# EasyEDA Pro project ProPrj_fallctf2025badge_2025-09-24.epro, board badge-v0.1_2025-02-24
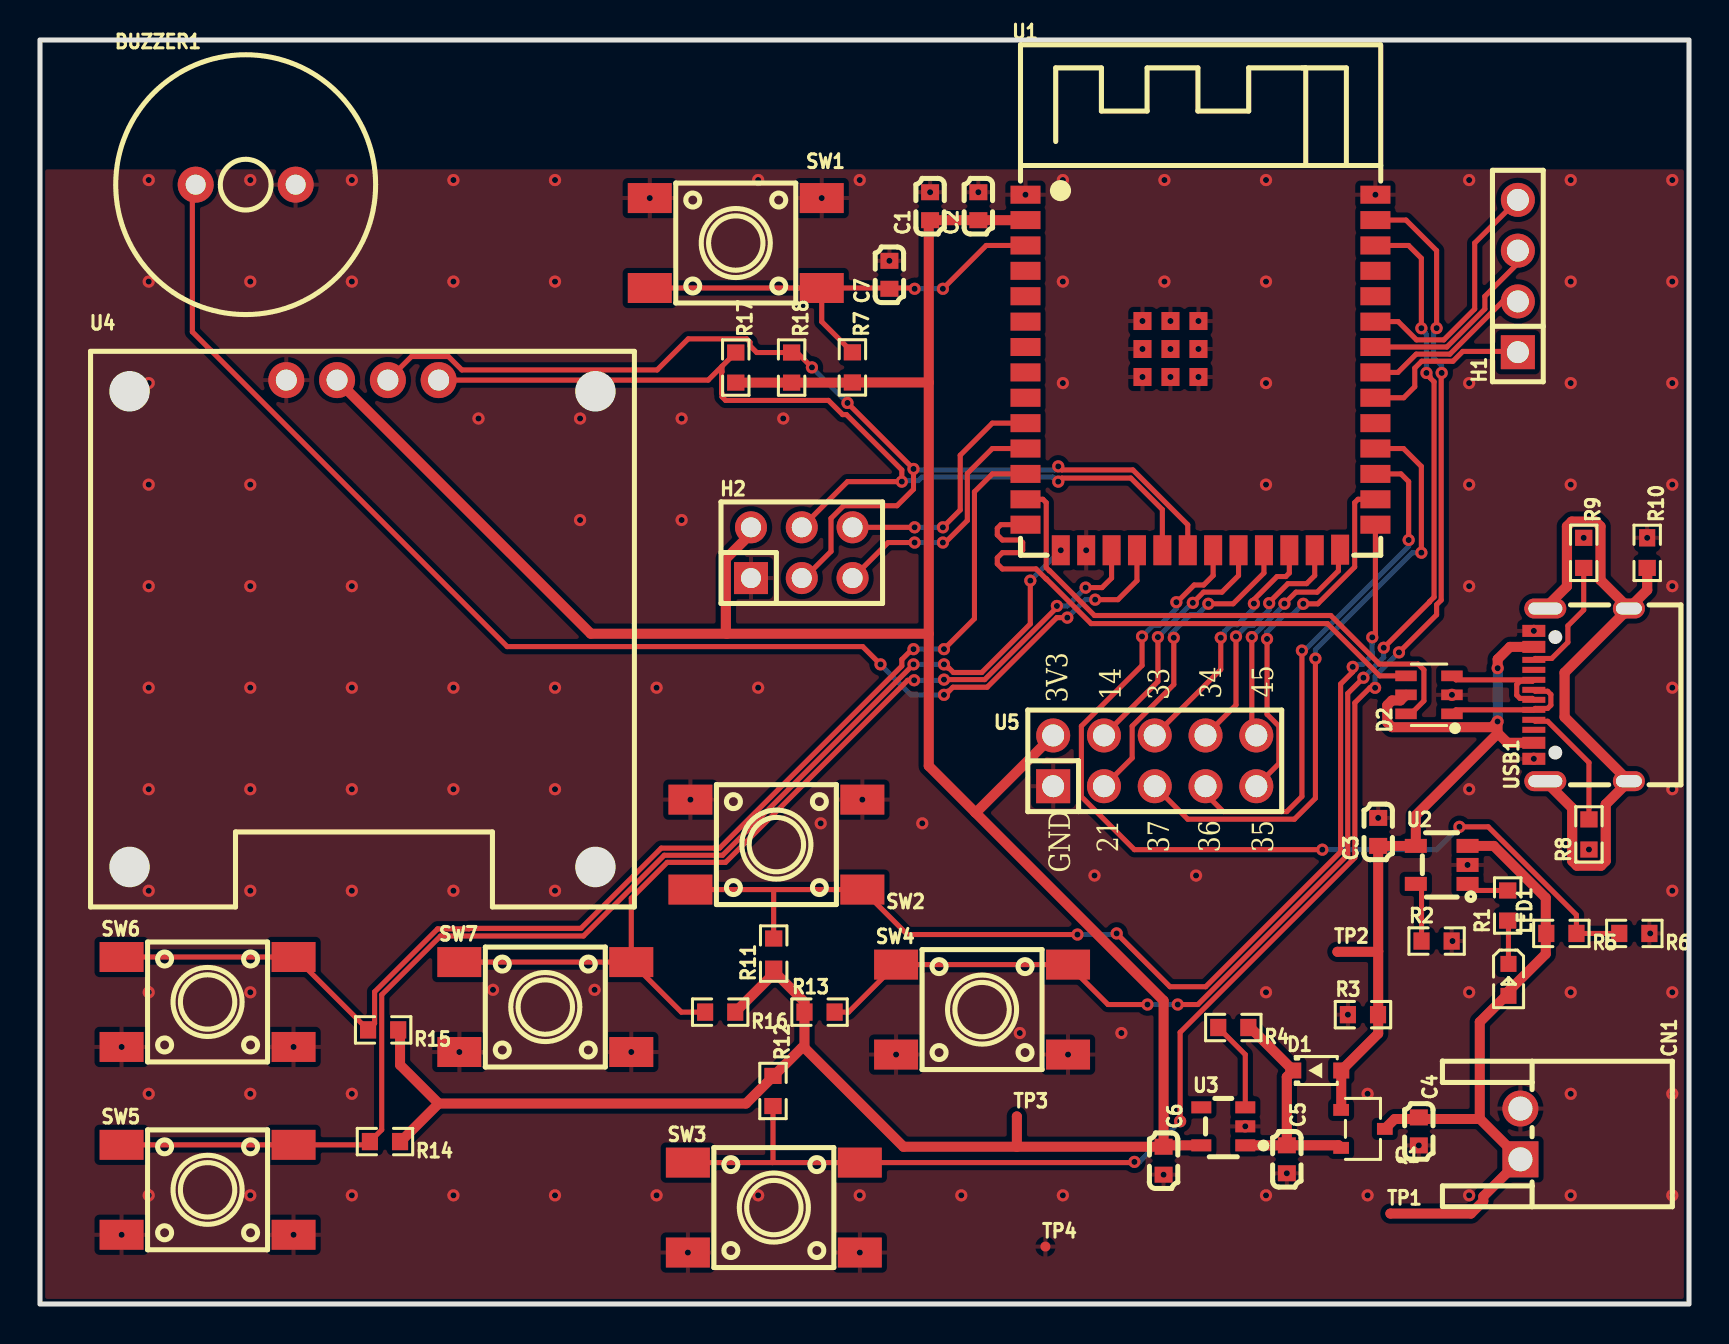
[diagram p13: board, top side]
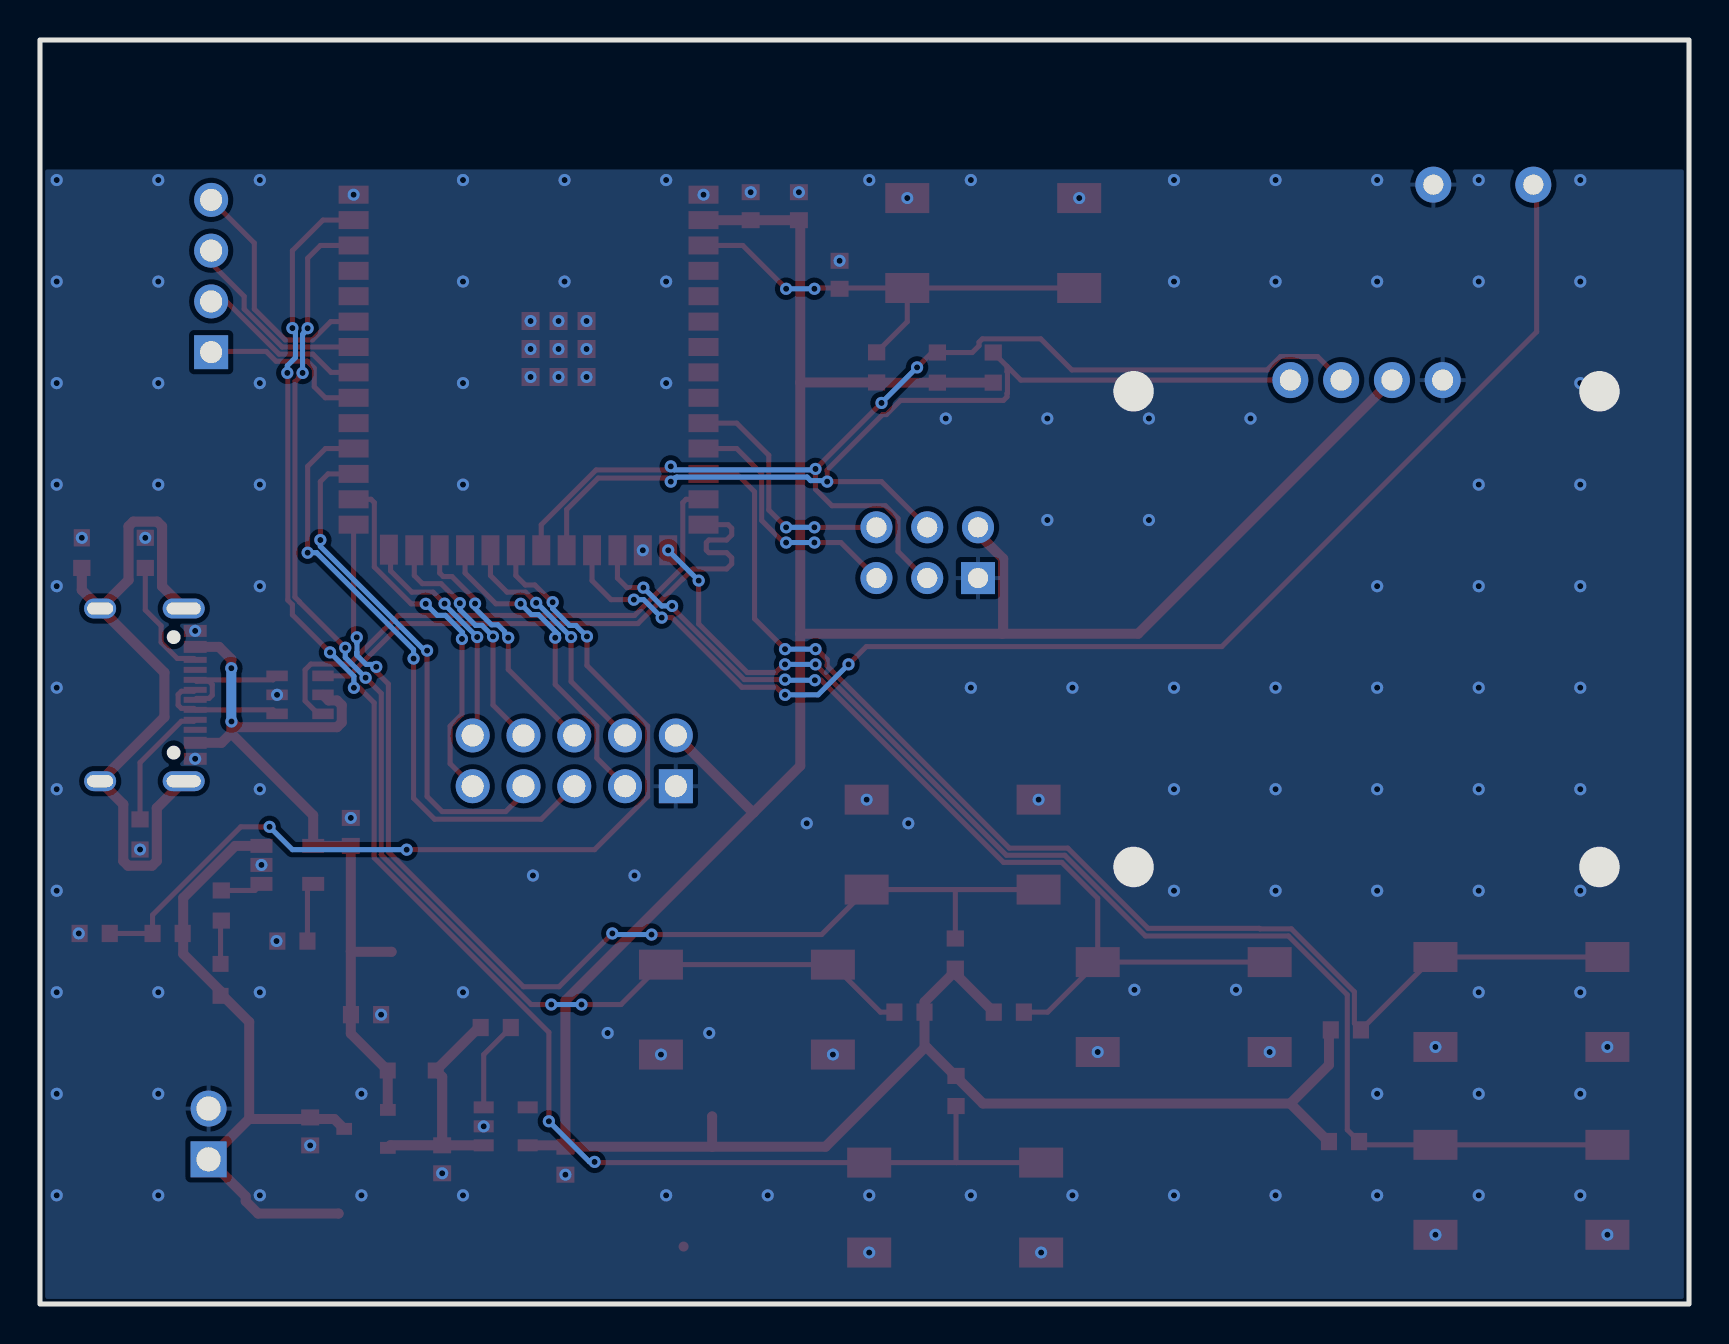
[diagram p14: board, bottom side, seen from below]

Outline 82.47 x 63.25 mm; copper layers: Top Layer, Bottom Layer. Coordinates in mm from the lower left corner of the outline.
Outline path: rectangle 0,63.25 82.47,0
Stack: Top Layer 0.035mm / Dielectric1 1.51mm FR4 er 4.5 / Bottom Layer 0.035mm

## Design rules (mm)
net D+: DP1
net D-: DP1
template: Custom Config
spacing copperThickness1oz (default): track to track 0.102, other pairs 0.15 to 0.3
spacing copperThickness2oz: track to track 0.203, other pairs 0.152 to 0.3
track width copperThickness1oz (default): min 0.127, default 0.254, max 2.54
track width copperThickness2oz: min 0.203, default 0.254, max 2.54
track width powerWidth: min 0.5, default 0.5, max 2.54
differential pair differentialPair (default): width min 0.127, default 0.254, max 2.54; gap min 0.152, default 0.152
via viaSize (default): diameter min 0.5, default 0.61, max 10; hole min 0.3, default 0.305, max 6.3
net +5V uses powerWidth
net +3.3V uses powerWidth
net VBAT uses powerWidth

## Placement (name value [footprint] x y rotation side)
BUZZER1  4kHz  [BUZ-TH_BD12.5-P5.00-D0.9]  10.29 56.01 0 top
C1  22uF  [C0603]  44.52 54.93 90 top
C2  100nF  [C0603]  46.93 54.93 90 top
C3  4.7uF  [C0603]  66.93 23.62 90 top
C4  10uF  [C0603]  68.96 8.64 270 top
C5  10uF  [C0603]  62.36 7.24 270 top
C6  10uF  [C0603]  56.2 7.17 270 top
C7  1uF  [C0603]  42.48 51.5 90 top
CN1  S2B-XH-A-1(LF)(SN)  [CONN-TH_S2B-XH-A-1-LF-SN]  74.04 8.51 270 top
D1  1N5819WS  [SOD-323_L1.7-W1.3-LS2.5-RD]  63.88 11.68 0 top
D2  USBLC6-2SC6  [SOT-23-6_L2.9-W1.6-P0.95-LS2.8-BL]  69.47 30.48 90 top
H1  2.54-1*4P母  [HDR-TH_4P-P2.54-V-F]  73.91 51.44 90 top
H2  PM2.54-2*3  [HDR-TH_6P-P2.54-V-F-R2-C3-S2.54]  38.1 37.59 0 top
LED1  D-060306R1/SS2/L  [LED0603-RD]  73.44 16.22 270 top
Q1  SSM3J338R,LF  [SOT-23F_L2.9-W1.8-P0.95-LS2.4-BR]  66.17 8.76 180 top
R1  300  [R0603#2]  73.41 19.94 90 top
R2  3.3K  [R0603#2]  69.85 18.16 0 top
R3  10K  [R0603#2]  66.17 14.48 0 top
R4  10K  [R0603#2]  59.68 13.83 180 top
R5  100K  [R0603#2]  76.09 18.54 180 top
R6  100K  [R0603#2]  79.74 18.54 180 top
R7  10K  [R0603#2]  40.63 46.86 270 top
R8  5K1  [R0603#2]  77.47 23.5 90 top
R9  5K1  [R0603#2]  77.21 37.58 270 top
R10  1M1  [R0603]  80.38 37.58 270 top
R11  10K  [R0603#2]  36.69 17.53 90 top
R12  10K  [R0603#2]  36.66 10.66 270 top
R13  10K  [R0603#2]  38.99 14.61 0 top
R14  10K  [R0603#2]  17.25 8.13 180 top
R15  10K  [R0603#2]  17.16 13.72 180 top
R16  10K  [R0603#2]  34.02 14.61 180 top
R17  4K7  [R0603#2]  34.8 46.85 270 top
R18  4K7  [R0603#2]  37.59 46.85 270 top
SW1  TS-1102S-C-C-B  [KEY-SMD_4P-L6.0-W6.0-P4.50-LS8.6]  34.8 53.09 180 top
SW2  TS-1102S-C-C-B  [KEY-SMD_4P-L6.0-W6.0-P4.50-LS8.6]  36.83 22.99 180 top
SW3  TS-1102S-C-C-B  [KEY-SMD_4P-L6.0-W6.0-P4.50-LS8.6]  36.7 4.83 0 top
SW4  TS-1102S-C-C-B  [KEY-SMD_4P-L6.0-W6.0-P4.50-LS8.6]  47.12 14.73 0 top
SW5  TS-1102S-C-C-B  [KEY-SMD_4P-L6.0-W6.0-P4.50-LS8.6]  8.38 5.72 0 top
SW6  TS-1102S-C-C-B  [KEY-SMD_4P-L6.0-W6.0-P4.50-LS8.6]  8.38 15.11 0 top
SW7  TS-1102S-C-C-B  [KEY-SMD_4P-L6.0-W6.0-P4.50-LS8.6]  25.27 14.86 0 top
TP1  -  [Test-Point-0.5mm]  67.54 4.53 0 top
TP2  -  [Test-Point-0.5mm]  64.89 17.62 0 top
TP3  -  [Test-Point-0.5mm]  48.86 9.38 0 top
TP4  -  [Test-Point-0.5mm]  50.29 2.88 0 top
U1  2.4GHz  [WIRELM-SMD_ESP32-S3-WROOM-1]  58.04 46.61 0 top
U2  TP4054  [TSOT-23-5_L2.9-W1.6-P0.95-LS2.8-BR]  70.1 21.97 0 top
U3  XC6220B331MR  [SOT-23-5_L2.9-W1.6-P0.95-LS2.8-BR]  59.18 8.89 0 top
U4  SSD1315  [OLED-TH_L27.8-W27.2-P2.54_C9900033791]  16.13 46.23 0 top
U5  ZX-PZ2.54-2-5PZZ  [HDR-TH_10P-P2.54-V-M-R2-C5-S2.54]  55.75 27.18 0 top
USB1  HC-TYPE-C-16P-01A-L  [USB-C-SMD_G-SWITCH_GT-USB-7010EN]  77.09 30.48 90 top

## Footprints (pads in the part's own frame, mm; a bottom-side part is the same pattern mirrored in y, then rotated)
BUZ-TH_BD12.5-P5.00-D0.9
  round 1.8 hole 1: 1(-2.5,0) 2(2.5,0)
C0603
  rect 0.8x0.9 smd: 1(-0.7,0) 2(0.7,0)
CONN-TH_S2B-XH-A-1-LF-SN
  rect 1.8x1.8 hole 1.2: 1(1.27,0)
  round 1.8 hole 1.2: 2(-1.27,0)
HDR-TH_4P-P2.54-V-F
  rect 1.7x1.7 hole 1.1: 1(-3.81,0)
  round 1.7 hole 1.1: 2(-1.27,0) 3(1.27,0) 4(3.81,0)
HDR-TH_6P-P2.54-V-F-R2-C3-S2.54
  rect 1.7x1.6 hole 1: 1(-2.54,-1.27)
  round 1.6 hole 1: 2(-2.54,1.27) 3(0,-1.27) 4(0,1.27) 5(2.54,-1.27) 6(2.54,1.27)
HDR-TH_10P-P2.54-V-M-R2-C5-S2.54
  rect 1.7x1.7 hole 1.1: 1(-5.08,-1.27)
  round 1.7 hole 1.1: 2(-5.08,1.27) 3(-2.54,-1.27) 4(-2.54,1.27) 5(0,-1.27) 6(0,1.27) 7(2.54,-1.27) 8(2.54,1.27) 9(5.08,-1.27) 10(5.08,1.27)
KEY-SMD_4P-L6.0-W6.0-P4.50-LS8.6
  rect 2.2x1.5 smd: 1(-4.3,2.25) 2(4.3,2.25) 3(-4.3,-2.25) 4(4.3,-2.25)
LED0603-RD
  rect 0.8x0.8 smd: 1(-0.799,0) 2(0.799,0)
OLED-TH_L27.8-W27.2-P2.54_C9900033791
  round 1.8 hole 1.05: 1(-3.81,0) 2(-1.27,0) 3(1.27,0) 4(3.81,0)
R0603
  rect 0.864x0.806 smd: 1(-0.753,0)
  rect 0.806x0.864 smd: 2(0.753,0)
R0603#2
  rect 0.806x0.864 smd: 1(-0.753,0) 2(0.753,0)
SOD-323_L1.7-W1.3-LS2.5-RD
  rect 0.8x0.8 smd: 1(-1.2,0) 2(1.2,0)
SOT-23-5_L2.9-W1.6-P0.95-LS2.8-BR
  rect 1x0.6 smd: 1(1.1,-0.95) 2(1.1,0) 3(1.1,0.95) 4(-1.1,0.95) 5(-1.1,-0.95)
SOT-23-6_L2.9-W1.6-P0.95-LS2.8-BL
  rect 0.532x1.072 smd: 1(-0.95,-1.149) 2(0,-1.149) 3(0.95,-1.149) 4(0.95,1.149) 5(0,1.149) 6(-0.95,1.149)
SOT-23F_L2.9-W1.8-P0.95-LS2.4-BR
  rect 0.785x0.595 smd: 1(1.093,-0.95) 2(1.093,0.95) 3(-1.093,0)
Test-Point-0.5mm
  round 0.5 smd: 1(0,0)
TSOT-23-5_L2.9-W1.6-P0.95-LS2.8-BR
  rect 1.1x0.7 smd: 1(1.294,-0.951) 2(1.294,-0.001) 3(1.294,0.951) 4(-1.294,0.951) 5(-1.294,-0.949)
USB-C-SMD_G-SWITCH_GT-USB-7010EN
  oval 1x2.1 hole 0.6x1.7: 1(-4.32,1.802) 2(4.32,1.802)
  oval 1x1.6 hole 0.6x1.3: 3(4.32,-2.377) 4(-4.32,-2.377)
  rect 0.6x1.15 smd: A1B12(-3.2,2.377) A4B9(-2.4,2.377) B1A12(3.2,2.377) B4A9(2.4,2.377)
  rect 0.3x1.15 smd: A5(-1.25,2.377) A6(-0.25,2.377) A7(0.25,2.377) A8(1.25,2.377) B5(1.75,2.377) B6(0.75,2.377) B7(-0.75,2.377) B8(-1.75,2.377)
WIRELM-SMD_ESP32-S3-WROOM-1
  rect 1.5x0.9 smd: 1(-8.75,8.895) 2(-8.75,7.625) 3(-8.75,6.355) 4(-8.75,5.085) 5(-8.75,3.815) 6(-8.75,2.545) 7(-8.75,1.275) 8(-8.75,0.005) 9(-8.75,-1.265) 10(-8.75,-2.535) 11(-8.75,-3.805) 12(-8.75,-5.075) 13(-8.75,-6.345) 14(-8.75,-7.615) 27(8.75,-7.615) 28(8.75,-6.345) 29(8.75,-5.075) 30(8.75,-3.805) 31(8.75,-2.535) 32(8.75,-1.265) 33(8.75,0.005) 34(8.75,1.275) 35(8.75,2.545) 36(8.75,3.815) 37(8.75,5.085) 38(8.75,6.355) 39(8.75,7.625) 40(8.75,8.895)
  rect 0.9x1.5 smd: 15(-6.985,-8.895) 16(-5.715,-8.895) 17(-4.445,-8.895) 18(-3.175,-8.895) 19(-1.905,-8.895) 20(-0.635,-8.895) 21(0.635,-8.895) 22(1.905,-8.895) 23(3.175,-8.895) 24(4.445,-8.895) 25(5.715,-8.895) 26(6.985,-8.865)
  rect 0.9x0.9 smd: 41(-2.9,2.575) 41(-2.9,1.175) 41(-2.9,-0.225) 41(-1.5,2.575) 41(-1.5,1.175) 41(-1.5,-0.225) 41(-0.1,2.575) 41(-0.1,1.175) 41(-0.1,-0.225)

## Nets
+3.3V: C1.1 C2.1 C6.1 H2.2 R7.2 R11.1 R12.1 R13.1 R14.1 R15.1 R16.1 R17.2 R18.2 TP3.1 U1.2 U3.5 U4.2 U5.2
+5V: C3.1 D1.2 D2.5 Q1.1 R3.2 TP2.1 U2.4 USB1.A4B9 USB1.B4A9
GND: BUZZER1.2 C1.2 C2.2 C3.2 C4.2 C5.2 C6.2 C7.2 CN1.2 D2.2 H2.1 R2.2 R3.1 R6.1 R8.1 R9.1 R10.1 SW1.3 SW1.4 SW2.3 SW2.4 SW3.3 SW3.4 SW4.3 SW4.4 SW5.3 SW5.4 SW6.3 SW6.4 SW7.3 SW7.4 TP4.1 U1.1 U1.16 U1.40 U1.41 U2.2 U3.2 U4.1 U5.1 USB1.A1B12 USB1.B1A12
VBAT: C4.1 CN1.1 LED1.2 Q1.3 R5.2 TP1.1 U2.3
BTN0: R11.2 SW2.1 SW2.2 U1.27
BTN1: R12.2 SW3.1 SW3.2 U1.39
BTN2: R13.2 SW4.1 SW4.2 U1.38
BTN3: R14.2 SW5.1 SW5.2 U1.15
BTN4: R15.2 SW6.1 SW6.2 U1.12
BTN5: R16.2 SW7.1 SW7.2 U1.17
BUZZ: BUZZER1.1 U1.18
CHG: R5.1 R6.2 U1.21
D+: D2.4 U1.14
D-: D2.6 U1.13
EN: C7.1 R7.1 SW1.1 SW1.2 U1.3
IO14: U1.22 U5.4
IO21: U1.23 U5.3
IO33: U1.24 U5.6
IO34: U1.25 U5.8
IO35: U1.28 U5.9
IO36: U1.29 U5.7
IO37: U1.30 U5.5
IO45: U1.26 U5.10
JTAG0: H1.1 U1.32
JTAG1: H1.2 U1.33
JTAG2: H1.3 U1.34
JTAG3: H1.4 U1.35
SAO1: H2.6 U1.10
SAO2: H2.5 U1.11
SCL: H2.3 R18.1 U1.20 U4.3
SDA: H2.4 R17.1 U1.19 U4.4
USBD+: D2.3 USB1.A6 USB1.B6
USBD-: D2.1 USB1.A7 USB1.B7
$1N7837: R9.2 USB1.B5
$1N7842: R8.2 USB1.A5
$1N22734: R1.2 U2.1
$1N22902: R2.1 U2.5
$1N23146: R4.2 U3.3
$1N23155: C5.1 D1.1 Q1.2 R4.1 U3.1
$1N29633: LED1.1 R1.1
$1N31344: R10.2 USB1.1 USB1.2 USB1.3 USB1.4

Pads without a net: U1 4 5 6 7 8 9 31 36 37; U3 4; USB1 A8 B8

## Via types
v1: diameter 0.61, hole 0.305, Top Layer to Bottom Layer, 210 vias

## Routing (per net, layer and track width the routed paths; a pad name or vN(x,y) marks a point on that pad's centre or on a via; arc(x,y) is an arc through that point)
+3.3V: length 169.5
  Top Layer w0.5: 19.94,10.03 35.31,10.03 38.1,12.82 38.24,12.82 ; 19.94,10.03 18.03,8.13 R14.1 ; 19.94,10.03 18.01,11.96 18.01,13.72 ; 44.45,33.54 44.45,26.92 46.78,24.59 ; 44.45,33.54 44.45,46.1 ; 44.45,33.54 27.55,33.54 U4.2 ; 38.24,12.82 R13.1 38.24,15.11 36.57,16.78 36.57,16.4 R16.1 ; 38.24,12.82 43.18,7.87 48.86,7.87 ; U1.2 49.28,54.23 C2.1 C1.1 44.45,54.16 44.45,46.1 ; 44.45,46.1 44.44,46.11 R7.2 40.62,46.1 R18.2 R17.2 ; 46.78,24.59 56.2,15.18 C6.1 ; 46.78,24.59 46.82,24.59 U5.2 ; C6.1 48.86,7.87 ; C6.1 56.26,7.94 58.08,7.94 ; 48.86,9.38 48.86,7.87
  Top Layer w0.508: 34.35,33.54 34.3,33.58 34.3,37.29 35.56,38.55 H2.2
+5V: length 40.8
  Top Layer w0.5: D2.5 68.04,30.2 67.62,30.2 67.38,29.96 67.38,29.1 67.62,28.86 72.61,28.86 v1(72.9,29.15) 72.9,28.58 ; USB1.B4A9 73.52,32.88 72.9,32.26 v1(72.9,31.81) ; 66.93,17.65 66.93,13.53 D1.2 65.08,9.72 Q1.1 ; 66.93,17.65 C3.1 U2.4 68.81,24.45 72.9,28.54 72.9,28.58 ; 66.93,17.65 66.9,17.62 TP2.1 ; USB1.A4B9 73.39,28.08 72.9,28.58
  Bottom Layer w0.5: v1(72.9,29.15) 72.9,29.15 v1(72.9,31.81)
GND:
  vias: v1(4.08,12.86) v1(4.08,3.47) v1(5.44,56.24) v1(5.44,51.16) v1(5.44,46.08) v1(5.44,41) v1(5.44,35.92) v1(5.44,30.84) v1(5.44,25.76) v1(5.44,20.68) v1(5.44,15.6) v1(5.44,10.52) v1(5.44,5.44) v1(10.52,56.24) v1(10.52,51.16) v1(10.52,41) v1(10.52,35.92) v1(10.52,30.84) v1(10.52,25.76) v1(10.52,20.68) v1(10.52,15.6) v1(10.52,10.52) v1(10.52,5.44) v1(12.68,12.86) v1(12.68,3.47) v1(15.6,56.24) v1(15.6,51.16) v1(15.6,35.92) v1(15.6,30.84) v1(15.6,25.76) v1(15.6,20.68) v1(15.6,10.52) v1(15.6,5.44) v1(20.68,56.24) v1(20.68,51.16) v1(20.68,30.84) v1(20.68,25.76) v1(20.68,20.68) v1(20.68,5.44) v1(20.97,12.61) v1(21.93,44.31) v1(22.66,15.72) v1(25.76,56.24) v1(25.76,51.16) v1(25.76,30.84) v1(25.76,25.76) v1(25.76,20.68) v1(25.76,5.44) v1(27.01,44.31) v1(27.01,39.23) v1(27.74,15.72) v1(29.57,12.61) v1(30.5,55.34) v1(30.84,30.84) v1(30.84,5.44) v1(32.09,44.31) v1(32.09,39.23) v1(32.4,2.58) v1(32.53,25.24) v1(35.92,56.24) v1(35.92,30.84) v1(35.92,5.44) v1(37.17,44.31) v1(39.05,24.05) v1(39.1,55.34) v1(41,56.24) v1(41,5.44) v1(41,2.58) v1(41.13,25.24) v1(42.48,52.2) v1(42.82,12.48) v1(44.13,24.05) v1(44.52,55.63) v1(46.08,5.44) v1(46.93,55.63) v1(49,13.56) v1(49.29,55.5) v1(51.16,56.24) v1(51.16,51.16) v1(51.16,46.08) v1(51.16,5.44) v1(51.42,12.48) v1(52.32,37.71) v1(52.74,21.44) v1(54.08,13.56) v1(55.14,49.18) v1(55.14,47.78) v1(55.14,46.38) v1(56.24,56.24) v1(56.24,51.16) v1(56.2,6.47) v1(56.54,49.18) v1(56.54,47.78) v1(56.54,46.38) v1(57.82,21.44) v1(57.94,49.18) v1(57.94,47.78) v1(57.94,46.38) v1(60.28,8.89) v1(61.32,56.24) v1(61.32,51.16) v1(61.32,46.08) v1(61.32,41) v1(61.32,15.6) v1(61.32,5.44) v1(62.36,6.54) v1(65.41,14.48) v1(66.4,10.52) v1(66.4,5.44) v1(66.79,55.5) v1(66.93,24.32) v1(68.96,7.94) v1(70.62,30.48) v1(70.65,18.16) v1(71.4,21.97) v1(71.48,56.24) v1(71.48,46.08) v1(71.48,41) v1(71.48,35.92) v1(71.48,25.76) v1(71.48,15.6) v1(71.48,5.44) v1(74.71,33.68) v1(74.71,27.28) v1(76.56,56.24) v1(76.56,51.16) v1(76.56,46.08) v1(76.56,41) v1(76.56,15.6) v1(76.56,10.52) v1(76.56,5.44) v1(77.21,38.34) v1(77.47,22.74) v1(80.38,38.34) v1(80.53,18.54) v1(81.64,56.24) v1(81.64,51.16) v1(81.64,46.08) v1(81.64,41) v1(81.64,35.92) v1(81.64,30.84) v1(81.64,25.76) v1(81.64,20.68) v1(81.64,15.6) v1(81.64,10.52) v1(81.64,5.44)
VBAT: length 33.1
  Top Layer w0.5: 74.29,7.64 74.28,7.62 ; 72.02,9.26 CN1.1 72.19,5.38 72.19,5.15 71.57,4.53 TP1.1 ; 72.02,9.26 67.75,9.26 Q1.3 ; 72.02,9.26 72.01,9.27 72.01,14.11 73.32,15.42 LED1.2 73.44,15.65 75.31,17.52 75.31,20.32 72.71,22.92 U2.3
BTN0: length 57.2
  Top Layer w0.254: v1(66.63,33.36) 66.79,33.52 U1.27 ; R11.2 36.69,20.71 36.66,20.74 ; 36.66,20.74 SW2.1 43.38,18.49 v1(51.89,18.49) ; 36.66,20.74 SW2.2 ; v1(65.66,31.88) 65.66,31.63 65.05,31.02 65.05,22.63 58.3,15.88 56.51,15.88 v1(53.85,18.54)
  Bottom Layer w0.254: v1(51.89,18.49) 53.79,18.49 v1(53.85,18.54) ; v1(66.63,33.36) 66.63,33.09 66.62,33.08 66.62,32.59 66.63,32.58 66.63,32.47 66.17,32 65.78,32 v1(65.66,31.88)
BTN1: length 81.4
  Top Layer w0.254: R12.2 36.66,7.1 36.64,7.08 ; 36.64,7.08 SW3.1 ; 36.64,7.08 SW3.2 54.7,7.08 v1(54.74,7.11) ; v1(57.02,9.14) 57.02,13.59 65.76,22.33 65.76,30.08 66.51,30.83 v1(66.77,30.83) ; v1(67.97,32.6) 69.85,34.49 69.85,34.99 70.08,35.22 70.08,46.56 v1(70.1,46.59) ; U1.39 68.32,54.23 69.85,52.71 v1(69.85,48.83)
  Bottom Layer w0.254: v1(57.02,9.14) 54.99,7.11 v1(54.74,7.11) ; v1(67.97,32.6) 66.77,31.41 v1(66.77,30.83) ; v1(69.85,48.83) 69.78,48.83 69.7,48.74 69.7,47.35 70.1,46.95 v1(70.1,46.59)
BTN2: length 65
  Top Layer w0.254: v1(69.09,48.82) 69.09,52.32 68.45,52.96 U1.38 ; R13.2 40.44,14.61 SW4.1 SW4.2 53.41,14.99 v1(55.39,14.99) ; v1(66.19,31.34) 65.41,30.55 65.41,22.48 57.91,14.99 v1(56.9,14.99) ; v1(69.34,46.59) 69.52,46.41 69.52,46.35 69.72,46.14 69.72,35.37 69.49,35.14 69.49,35.12 v1(67.21,32.84)
  Bottom Layer w0.254: v1(66.19,31.34) 67.21,32.35 v1(67.21,32.84) ; v1(69.09,48.82) 69.27,48.65 69.27,48.59 69.34,48.51 v1(69.34,46.59) ; 55.39,14.99 v1(56.9,14.99)
BTN3: length 64.9
  Top Layer w0.254: v1(43.69,32) 34.14,22.45 31.22,22.45 27.18,18.42 20.03,18.42 17.09,15.47 17.09,8.72 16.5,8.13 16.34,7.97 SW5.2 SW5.1 ; v1(49.53,36.2) 49.53,34.03 47.1,31.6 45.68,31.6 45.45,31.83 45.39,31.83 v1(45.21,32)
  Bottom Layer w0.254: v1(45.21,32) v1(43.69,32) ; v1(49.53,36.2) 49.53,36.2 v1(51.05,37.71)
BTN4: length 63.1
  Top Layer w0.254: SW6.1 SW6.2 12.76,17.36 R15.2 16.73,14.04 16.73,15.62 19.89,18.77 21.46,18.77 21.49,18.8 27.06,18.8 31.07,22.81 33.99,22.81 43.1,31.92 43.1,32.25 43.62,32.77 v1(43.69,32.77) ; U1.12 47.63,41.53 46.74,40.64 46.74,34.29 v1(45.21,32.77)
  Bottom Layer w0.254: v1(43.69,32.77) v1(45.21,32.77)
BTN5: length 48.6
  Top Layer w0.254: SW7.2 29.57,20.3 31.37,22.1 34.29,22.1 43.4,31.21 v1(43.72,31.21) ; SW7.2 SW7.1 ; SW7.2 32.08,14.61 33.27,14.61 ; v1(50.86,34.93) 50.86,34.85 47.25,31.24 v1(45.21,31.24) ; U1.17 53.59,36.32 53.12,35.85 v1(52.3,35.85)
  Bottom Layer w0.254: v1(43.72,31.21) 45.18,31.21 v1(45.21,31.24) ; v1(50.86,34.93) 51.38,34.93 v1(52.3,35.85)
BUZZ: length 66.1
  Top Layer w0.254: v1(45.21,30.48) 45.39,30.66 45.45,30.66 45.66,30.86 47.37,30.86 50.85,34.34 v1(51.38,34.34) ; v1(42.04,32) 41.15,32.89 23.37,32.89 7.62,48.64 7.62,55.84 BUZZER1.1 ; U1.18 54.86,36.2 53.91,35.24 v1(52.77,35.24)
  Bottom Layer w0.254: v1(45.21,30.48) 43.56,30.48 v1(42.04,32) ; v1(51.38,34.34) 52.28,35.24 v1(52.77,35.24)
CHG: length 46.8
  Top Layer w0.254: v1(70.99,23.88) 72.43,23.88 76.84,19.47 R5.1 78.99,18.54 ; v1(56.83,35.12) 56.86,35.12 57.72,35.98 58.2,35.98 58.67,36.45 U1.21 ; v1(55.12,33.4) 55.12,31.95 52.08,28.92 52.08,25.39 54.74,22.73 v1(64.13,22.73)
  Bottom Layer w0.254: v1(64.13,22.73) 69.85,22.73 v1(70.99,23.88) ; v1(56.83,35.12) 56.83,34.79 55.99,33.95 55.67,33.95 v1(55.12,33.4)
D+: length 28.1
  Top Layer w0.254: D2.4 67,31.43 64.39,34.04 52.57,34.04 50.34,36.28 50.32,36.28 49.82,36.78 48.13,36.78 47.88,37.03 47.88,37.34 48.13,37.59 49.02,37.59 49.15,37.72 49.15,38.1 49.02,38.23 48.13,38.23 47.88,38.48 47.88,38.81 48.06,38.99 U1.14
D-: length 28.1
  Top Layer w0.254: U1.13 50.16,40.26 50.32,40.1 50.32,36.85 50.49,36.69 50.5,36.69 52.74,34.45 64.56,34.45 66.99,32.02 68.93,32.02 69.22,31.73 69.22,30.18 68.57,29.53 68.32,29.53
EN: length 23.6
  Top Layer w0.254: SW1.1 39.1,49.15 R7.1 ; SW1.1 SW1.2 ; SW1.1 43.7,50.84 v1(43.74,50.8) ; U1.3 47.32,52.96 v1(45.16,50.8)
  Bottom Layer w0.254: v1(43.74,50.8) v1(45.16,50.8)
IO14: length 12.6
  Top Layer w0.254: U5.4 55.91,31.15 v1(55.91,33.37) ; v1(57.66,35.08) 58.19,35.62 59.12,35.62 59.94,36.45 U1.22
  Bottom Layer w0.254: v1(55.91,33.37) 57.63,35.08 v1(57.66,35.08)
IO21: length 16.2
  Top Layer w0.254: U5.3 54.62,27.32 54.62,28.92 56.71,31 v1(56.71,33.34) ; U1.23 61.21,36.58 59.67,35.04 v1(58.44,35.04)
  Bottom Layer w0.254: v1(56.71,33.34) 56.54,33.5 57.55,34.5 57.9,34.5 v1(58.44,35.04)
IO33: length 12.5
  Top Layer w0.254: U5.6 59.06,31.75 v1(59.06,33.34) ; U1.24 62.48,36.58 62.31,36.4 61.87,36.4 60.71,35.24 v1(60.71,35.05)
  Bottom Layer w0.254: v1(59.06,33.34) 59.23,33.52 59.23,33.64 59.57,33.99 59.89,33.99 60.71,34.81 v1(60.71,35.05)
IO34: length 12.3
  Top Layer w0.254: v1(59.82,33.4) 59.82,29.97 U5.8 ; U1.25 63.75,36.45 63.35,36.04 62.41,36.04 61.48,35.11 v1(61.48,35.07)
  Bottom Layer w0.254: v1(59.82,33.4) 59.82,33.41 60.37,33.96 60.69,33.96 61.48,34.74 v1(61.48,35.07)
IO35: length 18.5
  Top Layer w0.254: v1(61.37,33.28) 61.37,29.51 61.96,28.92 61.96,27.04 U5.9 ; U1.28 65.92,40.26 65.75,40.1 65.75,36.88 63.91,35.03 v1(63.18,35.03)
  Bottom Layer w0.254: v1(61.37,33.28) 61.34,33.31 61.34,33.6 62.2,34.46 62.61,34.46 v1(63.18,35.03)
IO36: length 25.7
  Top Layer w0.254: U1.29 68.07,41.53 68.45,41.15 v1(68.45,38.23) ; U5.7 58.29,25.53 59.18,24.64 62.36,24.64 63.11,25.39 v1(63.11,32.7)
  Bottom Layer w0.254: v1(68.45,38.23) 68.45,37.91 63.24,32.7 v1(63.11,32.7)
IO37: length 30.9
  Top Layer w0.254: v1(69.09,37.59) 69.09,41.91 68.19,42.8 U1.30 ; v1(63.79,32.29) 63.79,25.31 62.74,24.26 57.4,24.26 U5.5
  Bottom Layer w0.254: v1(63.79,32.29) 63.79,32.74 68.64,37.59 v1(69.09,37.59)
IO45: length 11.9
  Top Layer w0.254: v1(60.61,33.37) 60.61,28.67 U5.10 ; U1.26 64.94,37.74 64.94,36.69 63.87,35.62 62.81,35.62 v1(62.24,35.04)
  Bottom Layer w0.254: v1(60.61,33.37) 62.24,35 v1(62.24,35.04)
JTAG0: length 8.6
  Top Layer w0.254: H1.1 73.88,47.66 71.16,47.66 70.67,47.17 69.1,47.17 68.76,46.83 68.76,45.9 68.2,45.34 U1.32
JTAG1: length 8.6
  Top Layer w0.254: H1.2 73.15,50.17 70.51,47.53 68.83,47.53 67.91,46.61 U1.33
JTAG2: length 9.9
  Top Layer w0.254: H1.3 73.91,52.07 72.26,50.42 72.26,49.78 70.36,47.88 U1.34
JTAG3: length 12.3
  Top Layer w0.254: H1.4 71.75,53.09 71.75,49.78 70.21,48.24 68.85,48.24 67.93,49.15 U1.35
SAO1: length 12.4
  Top Layer w0.254: v1(45.16,38.86) 46.02,39.73 46.02,42.47 47.63,44.07 U1.10 ; v1(43.74,38.86) H2.6
  Bottom Layer w0.254: v1(45.16,38.86) v1(43.74,38.86)
SAO2: length 12.7
  Top Layer w0.254: H2.5 42.42,38.1 v1(43.74,38.1) ; U1.11 47.63,42.8 46.38,41.55 46.38,39.2 45.28,38.1 v1(45.16,38.1)
  Bottom Layer w0.254: v1(43.74,38.1) v1(45.16,38.1)
SCL: length 56.2
  Top Layer w0.254: H2.3 38.23,36.32 39.56,37.66 39.56,39.31 40.19,39.94 42.86,39.94 43.69,40.77 v1(43.69,41.78) v1(40.39,45.09) ; U4.3 18.58,47.41 20.43,47.41 21.1,46.74 30.87,46.74 32.42,48.29 35.35,48.29 35.51,48.13 35.51,47.95 35.85,47.61 37.86,47.61 v1(38.61,46.86) ; U1.20 57.4,38.99 54.66,41.73 51.1,41.73 v1(50.93,41.91)
  Bottom Layer w0.254: v1(43.69,41.78) 43.74,41.73 50.75,41.73 v1(50.93,41.91) ; v1(40.39,45.09) v1(38.61,46.86)
SDA: length 50
  Top Layer w0.254: 34.11,46.92 34.11,46.64 34.09,46.62 34.09,45.58 34.11,45.56 34.11,45.39 34.29,45.21 39.43,45.21 40.14,44.5 40.34,44.5 43.1,41.73 v1(43.1,41.15) 40.39,41.15 H2.4 ; 34.11,46.92 34.8,47.61 ; 34.11,46.92 33.42,46.23 U4.4 ; U1.19 56.13,39.75 54.56,41.33 51.1,41.33 v1(50.93,41.15)
  Bottom Layer w0.254: v1(43.1,41.15) 43.16,41.2 43.93,41.2 44.11,41.38 50.63,41.38 50.69,41.33 50.75,41.33 v1(50.93,41.15)
USBD+: length 6.6
  Top Layer w0.254: USB1.A6 74.64,30.3 74.02,30.3 73.86,30.46 73.86,31 74.02,31.16 74.64,31.16 USB1.B6 70.82,31.23 D2.3
USBD-: length 6.6
  Top Layer w0.254: USB1.A7 74.78,30.66 75.4,30.66 75.57,30.5 75.57,29.96 75.4,29.8 74.78,29.8 USB1.B7 70.82,29.73 70.62,29.53
$1N7837: length 6.1
  Top Layer w0.254: R9.2 77.21,34.73 76.42,33.93 76.42,33.11 75.61,32.3 74.78,32.3 USB1.B5
$1N7842: length 6.5
  Top Layer w0.254: USB1.A5 74.78,29.16 75.4,29.16 77.47,27.09 R8.2
$1N22734: length 2.1
  Top Layer w0.254: R1.2 71.73,20.69 71.4,21.02
$1N22902: length 3
  Top Layer w0.254: U2.5 69.1,20.74 R2.1
$1N23146: length 4.6
  Top Layer w0.254: R4.2 60.28,12.48 U3.3
$1N23155: length 11.9
  Top Layer w0.508: Q1.2 64.95,7.94 C5.1 ; 60.28,7.94 62.36,7.94 C5.1 ; C5.1 62.36,11.36 D1.1 60.53,13.83 60.43,13.83
$1N29633: length 2.2
  Top Layer w0.254: 73.44,17.02 73.44,19.15 R1.1
$1N31344: length 35.7
  Top Layer w0.508: 79.46,34.81 78.05,36.22 78.05,38.91 77.81,39.15 76.61,39.15 76.37,38.91 76.37,35.91 75.26,34.81 ; 79.46,34.81 80.38,35.72 R10.2 ; 79.46,34.81 76.25,31.59 76.25,29.37 79.46,26.16 ; 79.46,26.16 USB1.4 ; 79.46,26.16 78.31,25 78.31,22.17 78.07,21.93 76.87,21.93 76.63,22.17 76.63,24.81 USB1.1

## Copper pours and planes (outline as drawn; the poured copper is in the pictures)
GND on Top Layer: -3.56,56.77 84.96,56.77 84.96,-2.54 -3.56,-2.54
GND on Bottom Layer: -4.32,56.77 86.11,56.77 86.11,-2.54 -4.32,-2.54

## Text on the board
Top Silkscreen Layer: 3V3 | GND | 21 | 14 | 37 | 33 | 36 | 34 | 45 | 35
